# EAGLE design illuminator_bar (EAGLE 6.3)
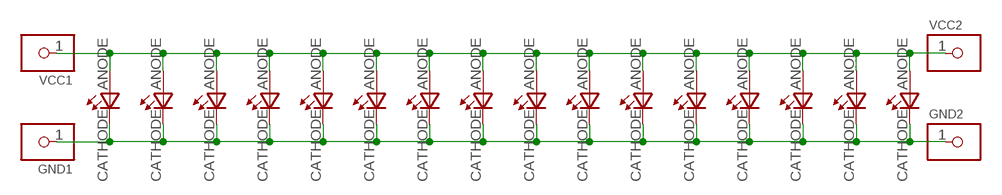
[diagram p0: schematic, sheet 1]

## Parts
GND1  1X0108L  [1X01_0.8_UNSIGNED_LONG]
GND2  1X0108L  [1X01_0.8_UNSIGNED_LONG]
U$1  NSCB100  [NSCB100]
U$2  NSCB100  [NSCB100]
U$3  NSCB100  [NSCB100]
U$4  NSCB100  [NSCB100]
U$5  NSCB100  [NSCB100]
U$6  NSCB100  [NSCB100]
U$7  NSCB100  [NSCB100]
U$8  NSCB100  [NSCB100]
U$9  NSCB100  [NSCB100]
U$10  NSCB100  [NSCB100]
U$11  NSCB100  [NSCB100]
U$12  NSCB100  [NSCB100]
U$13  NSCB100  [NSCB100]
U$14  NSCB100  [NSCB100]
U$15  NSCB100  [NSCB100]
U$16  NSCB100  [NSCB100]
VCC1  1X0108L  [1X01_0.8_UNSIGNED_LONG]
VCC2  1X0108L  [1X01_0.8_UNSIGNED_LONG]

## Nets
GND: GND1.1 GND2.1 U$1.CATHODE(C) U$2.CATHODE(C) U$3.CATHODE(C) U$4.CATHODE(C) U$5.CATHODE(C) U$6.CATHODE(C) U$7.CATHODE(C) U$8.CATHODE(C) U$9.CATHODE(C) U$10.CATHODE(C) U$11.CATHODE(C) U$12.CATHODE(C) U$13.CATHODE(C) U$14.CATHODE(C) U$15.CATHODE(C) U$16.CATHODE(C)
VCC: U$1.ANODE(A) U$2.ANODE(A) U$3.ANODE(A) U$4.ANODE(A) U$5.ANODE(A) U$6.ANODE(A) U$7.ANODE(A) U$8.ANODE(A) U$9.ANODE(A) U$10.ANODE(A) U$11.ANODE(A) U$12.ANODE(A) U$13.ANODE(A) U$14.ANODE(A) U$15.ANODE(A) U$16.ANODE(A) VCC1.1 VCC2.1

## Library data of the parts
GND1 GND2 VCC1 VCC2 = PIN:1X01
U$1-U$16 = LED:NSCB100

## Board
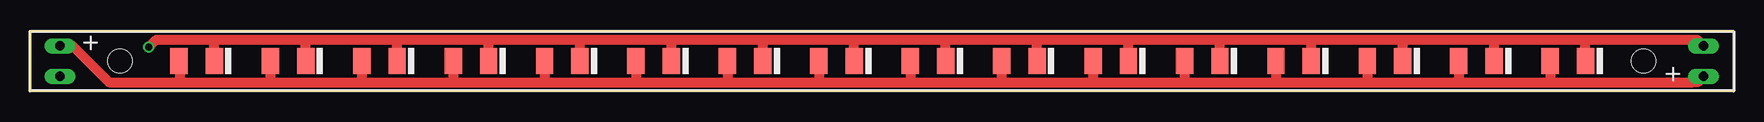
[diagram p1: board, top side]
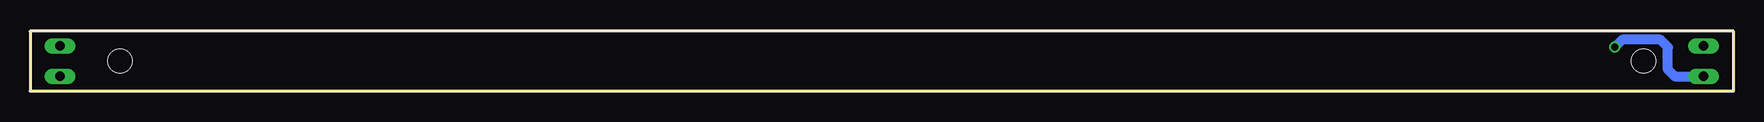
[diagram p2: board, bottom side, seen from below]

Size 142 x 5 mm. Coordinates in mm from the lower left corner, seen from the top.
Outline: 142,5 0,5 0,0 142,0 142,5
Copper layers (1*16): Top 0.035mm / dielectric 1.5mm / Bottom 0.035mm
Design rules "Fusion_eagle_rule_v1.1": minimum track width 6mil, minimum drill 12mil, track to track 6mil, track to pad 6mil, pad to pad 6mil, via to via 6mil, smd to smd 0mil, copper to edge 10mil, drill to drill 10mil, minimum pad ring 10mil, minimum via ring 6mil, stop-mask expansion 2mil, vias tented up to drill 100mil, thermal gap 10mil
Holes 2 mm at 134.5,2.5 7.5,2.5

### Footprints (pad centres in the part's own frame; a part is rotated, then mirrored left to right if it is on the bottom)
1X01_0.8_UNSIGNED_LONG = drill 0.8 long: 1 0,0
NSCB100 = smd 1.45 x 2.2: ANODE -1.475,0; CATHODE 1.475,0

### Placement (x,y rotation side)
GND1  2.5,1.23 90 top
GND2  139.5,3.77 90 top
U$1  128.19,2.5 0 top
U$2  120.57,2.5 0 top
U$3  112.95,2.5 0 top
U$4  105.33,2.5 0 top
U$5  97.71,2.5 0 top
U$6  90.09,2.5 0 top
U$7  82.47,2.5 0 top
U$8  74.85,2.5 0 top
U$9  67.23,2.5 0 top
U$10  59.61,2.5 0 top
U$11  51.99,2.5 0 top
U$12  44.37,2.5 0 top
U$13  36.75,2.5 0 top
U$14  29.13,2.5 0 top
U$15  21.51,2.5 0 top
U$16  13.89,2.5 0 top
VCC1  2.5,3.77 90 top
VCC2  139.5,1.23 90 top

### Tracks (layer width: path | path; a pad name or v marks a point on that pad's centre or on a via)
GND  (via drill 0.6)
  Top 0.406: 15.37,2.87 U$16.CATHODE | 129.66,2.87 U$1.CATHODE
  Top 0.813: 22.98,4.29 30.61,4.29 | 30.61,4.29 38.23,4.29 | 38.23,4.29 45.84,4.29 | 45.84,4.29 53.47,4.29 | 53.47,4.29 61.09,4.29 | 61.09,4.29 68.7,4.29 | 68.7,4.29 76.33,4.29 | 76.33,4.29 83.94,4.29 | 83.94,4.29 91.56,4.29 | 91.56,4.29 99.19,4.29 | 99.19,4.29 106.81,4.29 | 106.81,4.29 114.42,4.29 | 114.42,4.29 122.05,4.29 | U$7.CATHODE 83.94,4.29 | U$6.CATHODE 91.56,4.29 | U$5.CATHODE 99.19,4.29 | U$4.CATHODE 106.81,4.29 | U$3.CATHODE 114.42,4.29 | U$2.CATHODE 122.05,4.29 | U$8.CATHODE 76.33,4.29 | U$9.CATHODE 68.7,4.29 | U$10.CATHODE 61.09,4.29 | U$11.CATHODE 53.47,4.29 | U$12.CATHODE 45.84,4.29 | U$13.CATHODE 38.23,4.29 | U$14.CATHODE 30.61,4.29 | U$15.CATHODE 22.98,4.29 | 122.05,4.29 129.66,4.29 | 129.66,4.29 138.98,4.29 GND2.1 | U$1.CATHODE 129.66,4.29 | v9.91,3.66 10.54,4.29 15.37,4.29 | 15.37,4.29 22.98,4.29 | U$16.CATHODE 15.37,4.29
  Bottom 0.813: v9.91,3.66 9.27,4.29 6.1,4.29 5.46,3.66 5.46,1.78 4.91,1.23 GND1.1
VCC
  Top 0.813: 12.47,0.71 6.6,0.71 3.54,3.77 VCC1.1 | 12.47,0.71 20.04,0.71 | 20.04,0.71 27.66,0.71 | 27.66,0.71 35.27,0.71 | 35.27,0.71 42.9,0.71 | 42.9,0.71 50.52,0.71 | 50.52,0.71 58.13,0.71 | 58.13,0.71 65.75,0.71 | 65.75,0.71 73.38,0.71 | 73.38,0.71 81,0.71 | 81,0.71 88.61,0.71 | 88.61,0.71 96.23,0.71 | 96.23,0.71 103.86,0.71 | 103.86,0.71 111.47,0.71 | 111.47,0.71 119.09,0.71 | 119.09,0.71 126.72,0.71 | U$1.ANODE 126.72,0.71 | U$2.ANODE 119.09,0.71 | U$3.ANODE 111.47,0.71 | U$4.ANODE 103.86,0.71 | U$5.ANODE 96.23,0.71 | U$6.ANODE 88.61,0.71 | U$7.ANODE 81,0.71 | U$8.ANODE 73.38,0.71 | U$9.ANODE 65.75,0.71 | U$10.ANODE 58.13,0.71 | U$11.ANODE 50.52,0.71 | U$12.ANODE 42.9,0.71 | U$13.ANODE 35.27,0.71 | U$14.ANODE 27.66,0.71 | U$15.ANODE 20.04,0.71 | 126.72,0.71 138.61,0.71 138.98,0.71 VCC2.1 | U$16.ANODE 12.47,2.44 12.47,0.71

### Text on the board
tPlace: + | +